# Altium schematic sheet MSP430.SchDoc: MSP430F5529
size A4; SheetNumber: 1; SheetTotal: 1
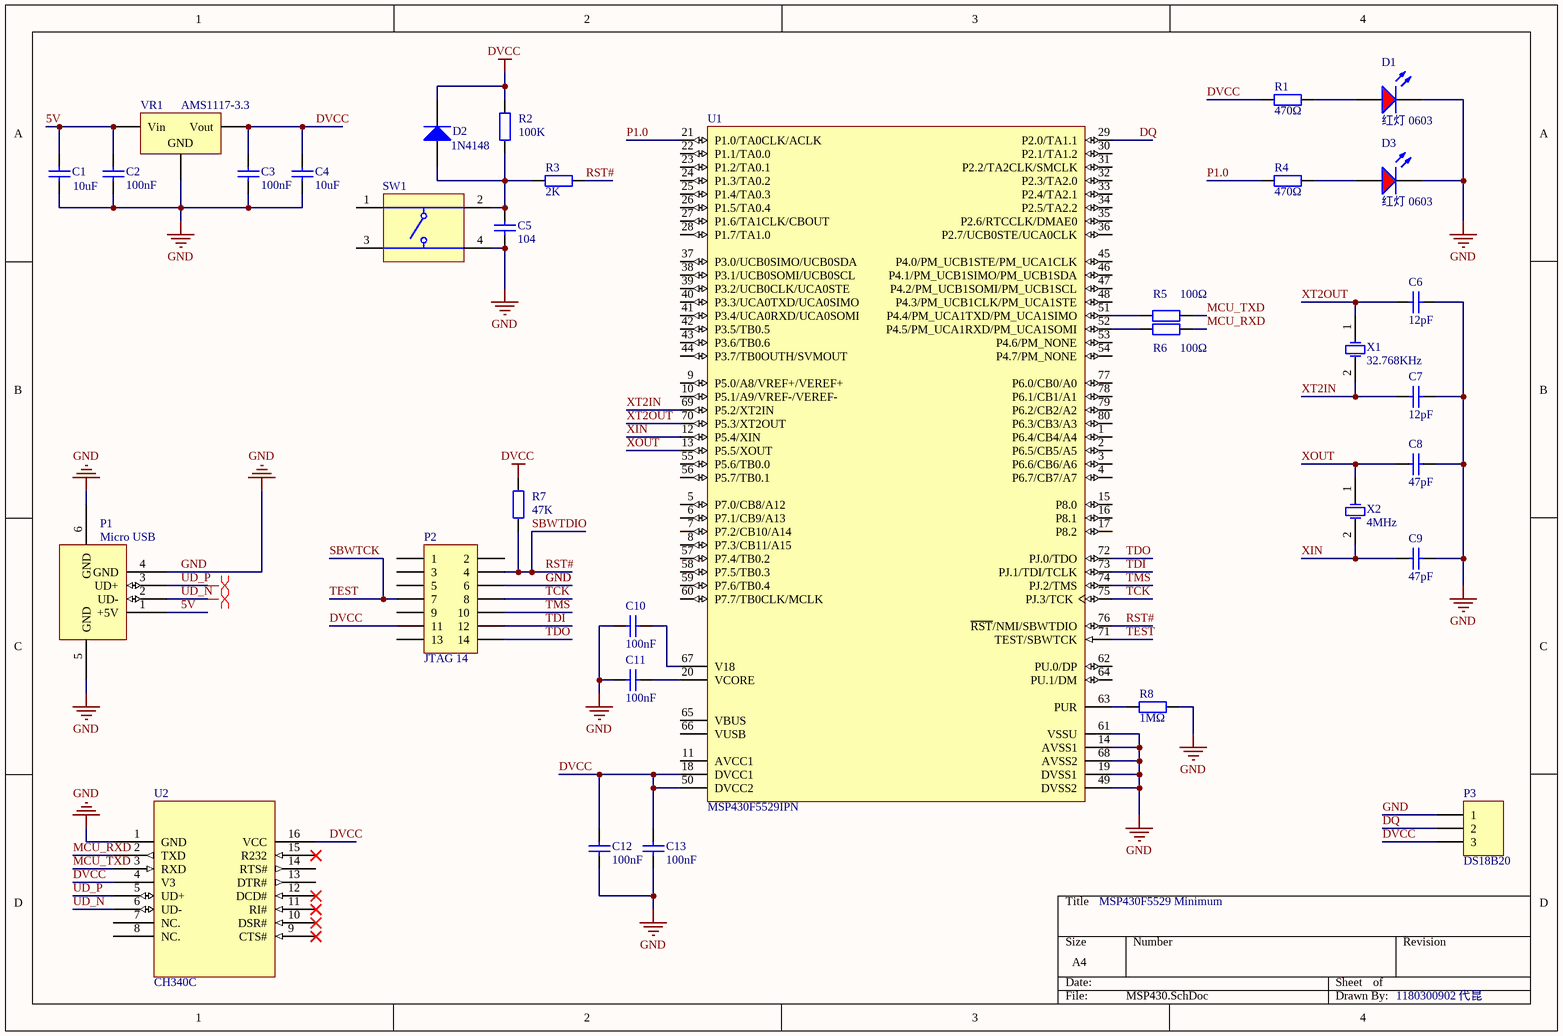
[diagram p0: MSP430.SchDoc]

## Parts
C1  10uF  [0603_C]
C2  100nF  [0603_C]
C3  100nF  [0603_C]
C4  10uF  [0603_C]
C5  104  [0603_C]
C6  12pF  [0603_C]
C7  12pF  [0603_C]
C8  47pF  [0603_C]
C9  47pF  [0603_C]
C10  100nF  [0603_C]
C11  100nF  [0603_C]
C12  100nF  [0603_C]
C13  100nF  [0603_C]
D1  红灯 0603  [0603_LED_S1]
D2  1N4148  [SOD-323]
D3  红灯 0603  [0603_LED_S1]
P1  Micro USB  [USBAM]
P2  JTAG 14  [HDR2X7]
P3  DS18B20  [HDR1X3]
R1  470Ω  [0603_R]
R2  100K  [0603_R]
R3  2K  [0603_R]
R4  470Ω  [0603_R]
R5  100Ω  [0603_R]
R6  100Ω  [0603_R]
R7  47K  [0603_R]
R8  1MΩ  [0603_R]
SW1  1825910-6  [TECO-1825910-6_V]  (value not drawn)
U1  MSP430F5529IPN  [TI-PN80_N]
U2  CH340C  [SOP16]
VR1  AMS1117-3.3  [SOT-223]
X1  32.768KHz  [ABRA-AB15T-2_V]
X2  4MHz  [ABRA-ABLS-14.7456MHZ-B2-T_V]

## Nets
DVCC: C3.2 C4.2 C12.2 C13.2 D2.2(K) P2.11 P3.3 R1.1 R2.2 R7.2 U1.18(DVCC1) U1.50(DVCC2) U2.4(V3) U2.16(VCC) VR1.2(Vout)
GND: C1.1 C2.1 C3.1 C4.1 C5.1 C6.2 C7.2 C8.2 C9.2 C10.1 C11.1 C12.1 C13.1 D1.K D3.K P1.4(GND) P1.5(GND) P1.6(GND) P2.6 P3.1 R8.2 SW1.4 U1.14(AVSS1) U1.19(DVSS1) U1.49(DVSS2) U1.61(VSSU) U1.68(AVSS2) U2.1(GND) VR1.1(GND)
5V: C1.2 C2.2 P1.1(+5V) VR1.3(Vin)
DQ: P3.2 U1.29(P2.0/TA1.1)
MCU_RXD: R6.2 U2.2(TXD)
MCU_TXD: R5.2 U2.3(RXD)
P1.0: R4.1 U1.21(P1.0/TA0CLK/ACLK)
RST#: P2.4 R3.2 R7.1 U1.76(~{RST}/NMI/SBWTDIO)  [also labelled SBWTDIO]
SBWTCK: P2.7 U1.71(TEST/SBWTCK)  [also labelled TEST]
TCK: P2.8 U1.75(PJ.3/TCK)
TDI: P2.12 U1.73(PJ.1/TDI/TCLK)
TDO: P2.14 U1.72(PJ.0/TDO)
TMS: P2.10 U1.74(PJ.2/TMS)
UD_N: P1.2(UD-) U2.6(UD-)
UD_P: P1.3(UD+) U2.5(UD+)
XIN: C9.1 U1.12(P5.4/XIN) X2.2(X2)
XOUT: C8.1 U1.13(P5.5/XOUT) X2.1(X1)
XT2IN: C7.1 U1.69(P5.2/XT2IN) X1.2(X2)
XT2OUT: C6.1 U1.70(P5.3/XT2OUT) X1.1(X1)
NetC5_2: C5.2 D2.1(A) R2.1 R3.1 SW1.2
NetC10_2: C10.2 U1.67(V18)
NetC11_2: C11.2 U1.20(VCORE)
NetD1_A: D1.A R1.2
NetD3_A: D3.A R4.2
NetR5_1: R5.1 U1.51(P4.4/PM_UCA1TXD/PM_UCA1SIMO)
NetR6_1: R6.1 U1.52(P4.5/PM_UCA1RXD/PM_UCA1SOMI)
NetR8_1: R8.1 U1.63(PUR)

Not connected (* = marked no-connect by the designer): P2 1 2 3 5 9 13; SW1 1 3; U1 1(P6.4/CB4/A4) 2(P6.5/CB5/A5) 3(P6.6/CB6/A6) 4(P6.7/CB7/A7) 5(P7.0/CB8/A12) 6(P7.1/CB9/A13) 7(P7.2/CB10/A14) 8(P7.3/CB11/A15) 9(P5.0/A8/VREF+/VEREF+) 10(P5.1/A9/VREF-/VEREF-) 11(AVCC1) 15(P8.0) 16(P8.1) 17(P8.2) 22(P1.1/TA0.0) 23(P1.2/TA0.1) 24(P1.3/TA0.2) 25(P1.4/TA0.3) 26(P1.5/TA0.4) 27(P1.6/TA1CLK/CBOUT) 28(P1.7/TA1.0) 30(P2.1/TA1.2) 31(P2.2/TA2CLK/SMCLK) 32(P2.3/TA2.0) 33(P2.4/TA2.1) 34(P2.5/TA2.2) 35(P2.6/RTCCLK/DMAE0) 36(P2.7/UCB0STE/UCA0CLK) 37(P3.0/UCB0SIMO/UCB0SDA) 38(P3.1/UCB0SOMI/UCB0SCL) 39(P3.2/UCB0CLK/UCA0STE) 40(P3.3/UCA0TXD/UCA0SIMO) 41(P3.4/UCA0RXD/UCA0SOMI) 42(P3.5/TB0.5) 43(P3.6/TB0.6) 44(P3.7/TB0OUTH/SVMOUT) 45(P4.0/PM_UCB1STE/PM_UCA1CLK) 46(P4.1/PM_UCB1SIMO/PM_UCB1SDA) 47(P4.2/PM_UCB1SOMI/PM_UCB1SCL) 48(P4.3/PM_UCB1CLK/PM_UCA1STE) 53(P4.6/PM_NONE) 54(P4.7/PM_NONE) 55(P5.6/TB0.0) 56(P5.7/TB0.1) 57(P7.4/TB0.2) 58(P7.5/TB0.3) 59(P7.6/TB0.4) 60(P7.7/TB0CLK/MCLK) 62(PU.0/DP) 64(PU.1/DM) 65(VBUS) 66(VUSB) 77(P6.0/CB0/A0) 78(P6.1/CB1/A1) 79(P6.2/CB2/A2) 80(P6.3/CB3/A3); U2 7(NC.) 8(NC.) 9(CTS#)* 10(DSR#)* 11(RI#)* 12(DCD#)* 13(DTR#) 14(RTS#) 15(R232)*

## Layout directives
differential pair: UD_N, UD_P

## Notes on the sheet
- MSP430F5529 Minimum
- 1180300902 代昆

## Library data of the parts
C1 C4 = 0603 10uF (106) 10% 10V: 贴片电容; ComponentLink1Description: 供应商链接; ComponentLink1URL: http://www.szlcsc.com/product/details_20411.html; Package: 0603; Supplier: LC; SuppliersPartNumber: C19702
C2 C3 C10-C13 = 0603 100nF (104) 10% 50V: 贴片电容; ComponentLink1Description: 供应商链接; ComponentLink1URL: http://www.szlcsc.com/product/details_15331.html; Package: 0603; Supplier: LC; SuppliersPartNumber: C14663
C5 = 0603 1uF (105) 10% 50V: 贴片电容; ComponentLink1Description: 供应商链接; ComponentLink1URL: http://www.szlcsc.com/product/details_16531.html; Package: 0603; Supplier: LC; SuppliersPartNumber: C15849
C6 C7 = 0603 12pF (120) 5% 50V: 贴片电容; ComponentLink1Description: 供应商链接; ComponentLink1URL: http://www.szlcsc.com/product/details_39506.html; Package: 0603; Supplier: LC; SuppliersPartNumber: C38523
C8 C9 = 0603 47pF (470) 5% 50V: 贴片电容; ComponentLink1Description: 供应商链接; ComponentLink1URL: http://www.szlcsc.com/product/details_2023.html; Package: 0603; Supplier: LC; SuppliersPartNumber: C1671
D1 D3 = 0603 红灯: 发光二极管; ComponentLink1Description: 供应商链接; ComponentLink1URL: http://www.szlcsc.com/product/details_2659.html; Package: 0603; Supplier: LC; SuppliersPartNumber: C2286
D2 = SOD-323 1N4148WS T4: 二极管; ComponentLink1Description: 供应商链接; ComponentLink1URL: http://www.szlcsc.com/product/details_2485.html; Package: SOD-323; Supplier: LC; SuppliersPartNumber: C2128
P1 = USB
P2 = Header 7X2: Header, 7-Pin, Dual row; LatestRevisionDate: 17-Jul-2002; LatestRevisionNote: Re-released for DXP Platform.; Publisher: Altium Limited
P3 = Header 3: Header, 3-Pin; LatestRevisionDate: 17-Jul-2002; LatestRevisionNote: Re-released for DXP Platform.; Publisher: Altium Limited
R1 R4 = 0603 470Ω (4700) 1%: 贴片电阻; ComponentLink1Description: 供应商链接; ComponentLink1URL: http://www.szlcsc.com/product/details_23906.html; Package: 0603; Supplier: LC; SuppliersPartNumber: C23179
R2 = 0603 2.7KΩ (2701) 1%: 贴片电阻; ComponentLink1Description: 供应商链接; ComponentLink1URL: http://www.szlcsc.com/product/details_13814.html; Package: 0603; Supplier: LC; SuppliersPartNumber: C13167
R3 = 0603 10KΩ (1002) 1%: 贴片电阻; ComponentLink1Description: 供应商链接; ComponentLink1URL: http://www.szlcsc.com/product/details_26547.html; Package: 0603; Supplier: LC; SuppliersPartNumber: C25804
R5 R6 = 0603 100Ω (1000) 1%: 贴片电阻; ComponentLink1Description: 供应商链接; ComponentLink1URL: http://www.szlcsc.com/product/details_23502.html; Package: 0603; Supplier: LC; SuppliersPartNumber: C22775
R7 = 0603 47KΩ (4702) 1%: 贴片电阻; ComponentLink1Description: 供应商链接; ComponentLink1URL: http://www.szlcsc.com/product/details_26562.html; Package: 0603; Supplier: LC; SuppliersPartNumber: C25819
R8 = 0603 1MΩ (1004) 1%: 贴片电阻; ComponentLink1Description: 供应商链接; ComponentLink1URL: http://www.szlcsc.com/product/details_23662.html; Package: 0603; Supplier: LC; SuppliersPartNumber: C22935
SW1 = CMP-1684-00021-1: Tact Switch, SPST-NO, 0.05 A, -35 to 85 degC, 4-Pin THD, RoHS, Bulk; Manufacturer: TE Connectivity; Maximum Contact Resistance: 100mOhm; Mechanical Life: 100000Cycles; Bushing Type: Unthreaded; Switch Configuration: OFF(ON); Maximum DC Voltage Rating: 24V; Contact Rating @ Voltage: 0.05A@24VDC; Actuator Color: Black; Body Orientation: Straight; Function: MomentaryContact; Illumination: N/R; Actuator Style: RoundButton; Actuator Material: PolybutyleneTerephthalate; Dielectric Strength: 500VAC; Pole Throw Configuration: SPST; Actuator Length: 1.4mm; Product Weight: N/A; Contact Material: CopperAlloy; Housing Material: N/A; Terminal Type: PCPins; Minimum Insulation Resistance: 100MOhm; Package Description: 4-Pin Through Hole Device, Body 5.99 x 5.99 mm, Pitch 6.5 mm; Part No: 1825910-6; Package Reference: THD; Base Material: N/A; Manufacturer URL: http://www.te.com; Contact Plating: Silver; RoHS: Yes; Datasheet Version: Rev. C9; Electrical Life: 100000Cycles; Maximum AC Voltage Rating: N/A; Thread Size: N/R; Operating Temperature: -35to85C; Mounting: ThroughHole; Dimension: 5.99x5mm; Datasheet URL: http://www.te.com/commerce/DocumentDelivery/DDEController?Action=showdoc&DocId=Customer+Drawing%7F1825910%7FC9%7Fpdf%7FEnglish%7FENG_CD_1825910_C9.pdf%7F1825910-6; Family: 1825910; Seal Location: N/A; Seal Description: N/A; Packaging: N/A
U1 = MSP430F5529IPN: 25 MHz Mixed Signal Microcontroller with 128 KB Flash, 8192 B SRAM and 63 GPIOs, -40 to 85 degC, 80-pin QFP (PN), Green (RoHS & no Sb/Br); Manufacturer: Texas Instruments; ADC: 12-bit SAR; ADC Channels: 16; Brown Out Reset: Yes; DMA: 3; Flash(KB): 128; Frequency(MHz): 25; GPIO: 63; Multiplier: 32x32; SRAM(B): 8192; SubFamily: 5 Series; Timers - 16-bit: 4; USB: 1; USCI_A (UART/LIN/IrDA/SPI): 2; DatasheetVersion: SLAS590I; PackageReference: PN80; PackageDescription: 80-Pin Plastic Quad Flat Pack, Body 12 x 12 mm, Pitch 0.5 mm; Supplier 1: Digi-Key; Supplier Part Number 1: 296-27379-2-ND; Supplier 2: Digi-Key; Supplier Part Number 2: 296-27379-1-ND; Supplier 3: Digi-Key; Supplier Part Number 3: 296-27379-6-ND; Supplier 4: Newark; Supplier Part Number 4: 55W6845; Supplier 5: Mouser; Supplier Part Number 5: 595-MSP430F5528IZQER; Comparators: Yes; Eco-Plan: Green (RoHS & no Sb/Br); Real-Time Clock: Yes; SVS: Yes; Temp Sensor: Yes; USCI_B (I2C & SPI): 2; Watchdog: Yes; Mounting Technology: Surface Mount; Code_JEDEC: MS-018; PartNumber: MSP430F5529IPN; ComponentLink1Description: Manufacturer URL; ComponentLink1URL: http://www.ti.com/; ComponentLink2Description: Datasheet; ComponentLink2URL: http://www.ti.com/general/docs/lit/getliterature.tsp?genericPartNumber=MSP430F5529&fileType=pdf; ComponentLink3Description: Package Specification; ComponentLink3URL: http://www.ti.com/lit/ml/mtqf010a/mtqf010a.pdf
U2 = CH340C: USB to Serial / UART
VR1 = SOT-223 AMS1117-3.3: 低压差线性稳压(LDO); ComponentLink1Description: 供应商链接; ComponentLink1URL: http://www.szlcsc.com/product/details_6652.html; Package: SOT-223; Supplier: LC; SuppliersPartNumber: C6186
X1 = CMP-1326-00001-1: 晶振; PartNumber: AB15T-32.768KHZ; Manufacturer: Abracon; ESR: 40 KOhm Max.; Shunt Capacitance C0: 1 pF Typ.; Packing: Bulk; Load Capacitance CL: 12.5 pF; ComponentLink1URL: http://www.abracon.com/; Temperature Range: -20 to 70 degC; ComponentLink1Description: Manufacturer URL; PackageDescription: 2-Pin THD, Body 5 x 1.4 mm, Pin Spacing 0.45 mm; Frequency: 32.768 kHz; ComponentLink2URL: http://www.abracon.com/Resonators/AB15T.pdf; ComponentLink2Description: Datasheet; ComponentLink3Description: Package Specification; DatasheetVersion: Jun-10; Mounting Technology: Through Hole; RoHS: TRUE; ComponentLink3URL: http://www.abracon.com/Resonators/AB15T.pdf
X2 = CMP-2000-05726-1: 晶振; Brand: ABRACON; Case Length: 11.4mm; Frequency Stability: 50PPM; ESR: 80Ohms; Case Height: 4.2mm; Tolerance: 30PPM; Frequency: 8MHz; Case Width: 4.7mm; Load Capacitance: 18pF; Datasheet Version: 04/2011; Termination Style: SMD/SMT; Dimensions: 4.7mmWx11.4mmLx4.2mmH; Packaging: Reel; Manufacturer: ABRACON; Package URL: http://www.abracon.com/Support/PackageDrawing/Resonators/ABLS-2D.pdf; Mounting Technology: SurfaceMount; Package Reference: ABLS-14.7456MHZ-B2-T; Product Category: Crystals; Package Description: 2-Pin Surface Mount Device, Body 11.4 x 4.7 mm; Package / Case: HC-49/US; Mounting Style: SMD/SMT; Operating Temperature Range: -20Cto+70C; Series: ABLS; Factory Pack Quantity: 1000; Datasheet URL: http://www.abracon.com/Resonators/abls.pdf; Manufacturer URL: http://www.abracon.com/; RoHS: Details; Type: LowProfileMicroprocessorCrystal